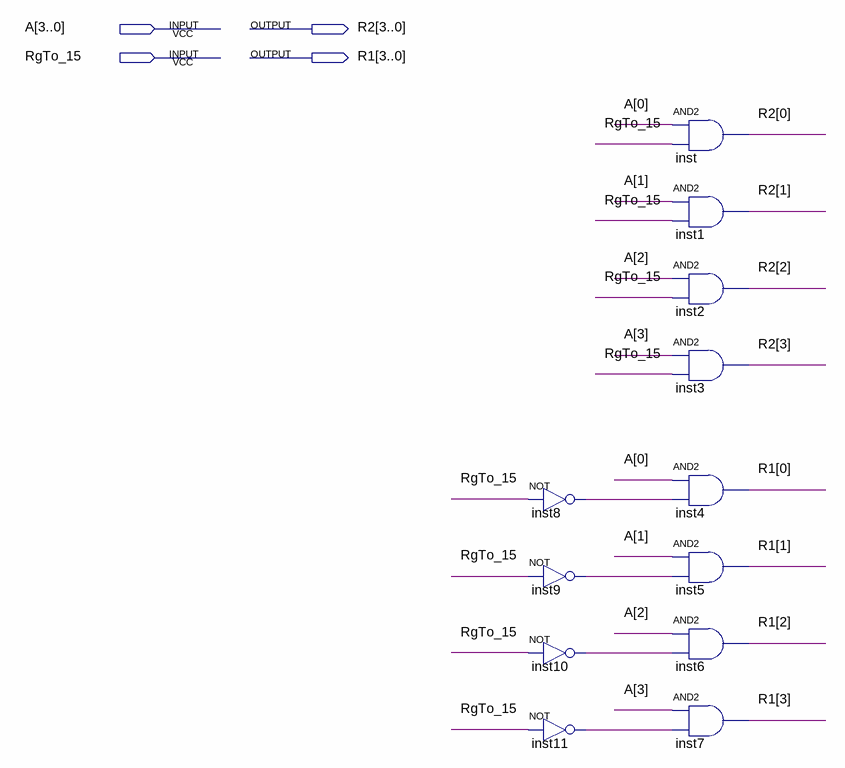
[diagram p0: schematic sheet]
// Quartus schematic Demultiplex.bdf as structural Verilog: 12 symbols, 4 pins
module Demultiplex (
  input  [3:0] A,
  input  RgTo_15,
  output [3:0] R2,
  output [3:0] R1
);

  wire inst8_out, inst9_out, inst10_out, inst11_out;

  not inst8 (inst8_out, RgTo_15);
  not inst9 (inst9_out, RgTo_15);
  not inst10 (inst10_out, RgTo_15);
  not inst11 (inst11_out, RgTo_15);
  and inst (R2[0], A[0], RgTo_15);
  and inst1 (R2[1], A[1], RgTo_15);
  and inst2 (R2[2], A[2], RgTo_15);
  and inst3 (R2[3], A[3], RgTo_15);
  and inst4 (R1[0], A[0], inst8_out);
  and inst5 (R1[1], A[1], inst9_out);
  and inst6 (R1[2], A[2], inst10_out);
  and inst7 (R1[3], A[3], inst11_out);
endmodule
